# Altium schematic sheet IO.SchDoc: SR4K_PHY6222_SIMPLIFY
size A4; Revision: V1.2; SheetNumber: 5; SheetTotal: 5
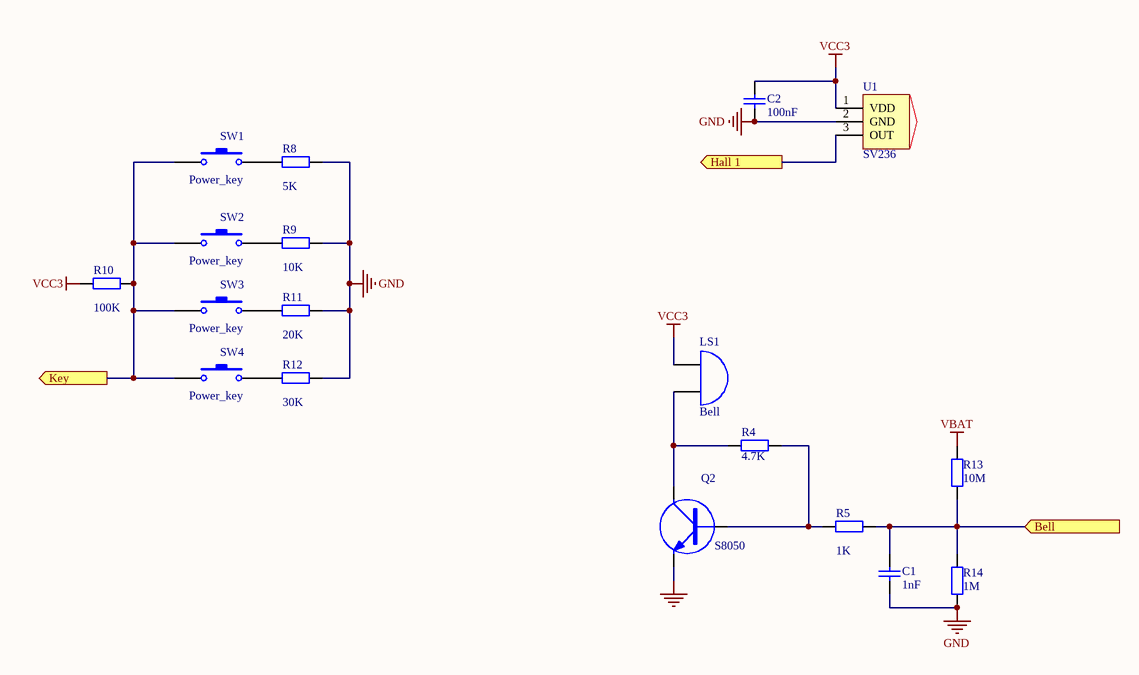
[diagram p0: IO.SchDoc]

## Parts
C1  value 1nF  [RAD-0.3]  (hidden comment: Cap)
C2  value 100nF  [RAD-0.3]  (hidden comment: Cap)
LS1  Bell
Q2  S8050  [SOT-23]
R4  value 4.7K  (hidden comment: 100K)
R5  value 1K  (hidden comment: Res2)
R8  value 5K  (hidden comment: Res2)
R9  value 10K  (hidden comment: Res2)
R10  value 100K  (hidden comment: Res2)
R11  value 20K  (hidden comment: Res2)
R12  value 30K  (hidden comment: Res2)
R13  value 10M  (hidden comment: Res2)
R14  value 1M  (hidden comment: Res2)
SW1  Power_key
SW2  Power_key
SW3  Power_key
SW4  Power_key
U1  SV236  [sot-23-3]

## Ports
Bell (in), Hall 1 (out), Key (out)

## Nets
GND: C1.2 C2.2 Q2.2(E) R8.2 R9.2 R11.2 R12.2 R14.1 U1.2(GND)
VBAT: R13.2
VCC3: C2.1 LS1.1(A) R10.1 U1.1(VDD)
Bell: C1.1 R5.2 R13.1 R14.2 ; port Bell
Hall 1: U1.3(OUT) ; port Hall 1
Key: R10.2 SW1.1 SW2.1 SW3.1 SW4.1 ; port Key
NetLS1_2: LS1.2(B) Q2.3(C) R4.2
NetQ2_1: Q2.1(B) R4.1 R5.1
NetR8_1: R8.1 SW1.2
NetR9_1: R9.1 SW2.2
NetR11_1: R11.1 SW3.2
NetR12_1: R12.1 SW4.2

## Notes on the sheet
- Title
- Size:
- Date:
- A4
- Number:
- Time:
- Revision:
- Sheet
- emmovo@outlook.com
- of
- File:

## Library data of the parts
C1 C2 = Cap: Capacitor; Published: 8-Jun-2000; LatestRevisionDate: 17-Jul-2002; LatestRevisionNote: Re-released for DXP Platform.; PackageReference: RAD-0.3; Publisher: Altium Limited; PackageDescription: Radial Cap, Thru-Hole; 2 Leads; 0.3 in Pin Spacing
LS1 = Bell: Electrical Bell; Published: 24-Mar-1999; LatestRevisionDate: 17-Jul-2002; LatestRevisionNote: Re-released for DXP Platform.; PackageReference: PIN2; Publisher: Altium Limited
Q2 = NPN: NPN Transistor
R4 R5 R8-R14 = Res2: Resistor; Published: 8-Jun-2000; LatestRevisionDate: 17-Jul-2002; LatestRevisionNote: Re-released for DXP Platform.; PackageReference: AXIAL-0.4; Publisher: Altium Limited; PackageDescription: Axial Device, Thru-Hole; 2 Leads; 0.4 in Pin Spacing
SW1-SW4 = SW-PB: Switch; Published: 24-Mar-1999; LatestRevisionDate: 17-Jul-2002; LatestRevisionNote: Re-released for DXP Platform.; PackageReference: SPST-2; Publisher: Altium Limited
U1 = 霍尔44E 938